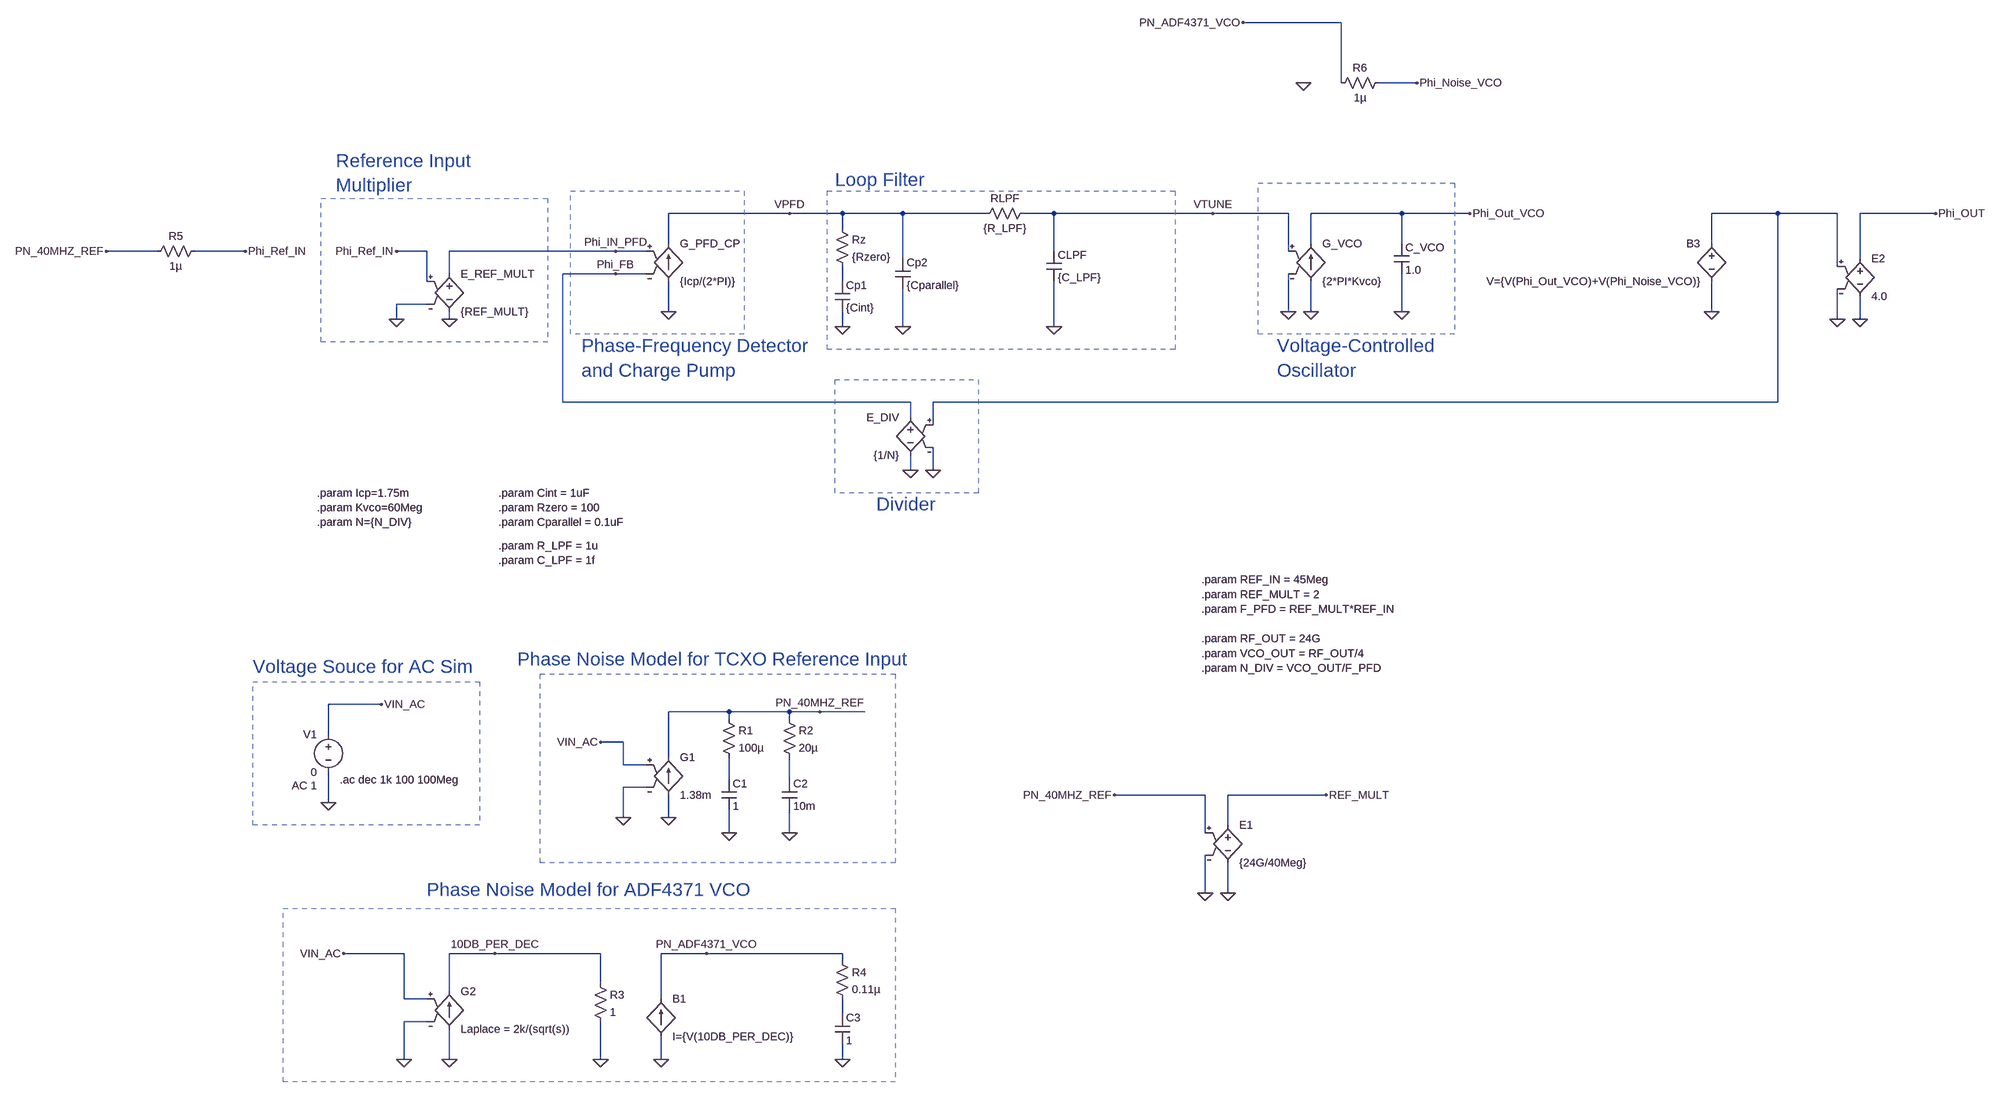
[diagram p0: schematic ADF4371_Freq_Synth_AC_Model.asc]
ADF4371_Freq_Synth_AC_Model.asc, the LTspice schematic file:
Version 4
SHEET 1 1592 2628
WIRE -64 -320 -272 -320
WIRE -64 -192 -64 -320
WIRE 96 -192 16 -192
WIRE -1232 128 -1488 128
WIRE -1120 128 -1232 128
WIRE -992 128 -1120 128
WIRE -816 128 -992 128
WIRE -672 128 -736 128
WIRE -336 128 -672 128
WIRE -176 128 -336 128
WIRE 64 128 -128 128
WIRE 208 128 64 128
WIRE 880 128 720 128
WIRE 1008 128 880 128
WIRE 1216 128 1056 128
WIRE -1120 160 -1120 128
WIRE -1488 192 -1488 128
WIRE -128 192 -128 128
WIRE 64 192 64 128
WIRE 720 192 720 128
WIRE -2576 208 -2688 208
WIRE -2384 208 -2496 208
WIRE -2000 208 -2064 208
WIRE -1600 208 -1952 208
WIRE -1536 208 -1600 208
WIRE -672 208 -672 128
WIRE -176 208 -176 128
WIRE -992 224 -992 128
WIRE 1056 224 1056 128
WIRE 1008 240 1008 128
WIRE -1952 256 -1952 208
WIRE -1600 256 -1712 256
WIRE -1536 256 -1600 256
WIRE -2000 272 -2000 208
WIRE -1120 272 -1120 240
WIRE -2000 320 -2064 320
WIRE -1488 336 -1488 272
WIRE -176 336 -176 256
WIRE -128 336 -128 272
WIRE 64 336 64 256
WIRE 720 336 720 272
WIRE -2064 352 -2064 320
WIRE -1952 352 -1952 336
WIRE 1008 352 1008 288
WIRE 1056 352 1056 304
WIRE -1120 368 -1120 336
WIRE -992 368 -992 288
WIRE -672 368 -672 272
WIRE -1712 528 -1712 256
WIRE -976 528 -1712 528
WIRE 880 528 880 128
WIRE 880 528 -928 528
WIRE -976 560 -976 528
WIRE -928 576 -928 528
WIRE -976 672 -976 640
WIRE -928 672 -928 624
WIRE -2096 1168 -2208 1168
WIRE -1360 1184 -1488 1184
WIRE -1232 1184 -1360 1184
WIRE -1168 1184 -1232 1184
WIRE -1072 1184 -1168 1184
WIRE -1360 1200 -1360 1184
WIRE -1232 1200 -1232 1184
WIRE -2208 1232 -2208 1168
WIRE -1584 1248 -1632 1248
WIRE -1488 1280 -1488 1184
WIRE -1584 1296 -1584 1248
WIRE -1536 1296 -1584 1296
WIRE -1360 1328 -1360 1280
WIRE -1232 1328 -1232 1280
WIRE -1536 1344 -1584 1344
WIRE -352 1360 -544 1360
WIRE -96 1360 -304 1360
WIRE -2208 1376 -2208 1312
WIRE -1584 1408 -1584 1344
WIRE -1488 1408 -1488 1360
WIRE -304 1424 -304 1360
WIRE -1360 1440 -1360 1392
WIRE -1232 1440 -1232 1392
WIRE -352 1440 -352 1360
WIRE -352 1568 -352 1488
WIRE -304 1568 -304 1504
WIRE -2048 1696 -2176 1696
WIRE -1856 1696 -1952 1696
WIRE -1632 1696 -1856 1696
WIRE -1408 1696 -1504 1696
WIRE -1120 1696 -1408 1696
WIRE -1120 1712 -1120 1696
WIRE -1632 1760 -1632 1696
WIRE -1952 1776 -1952 1696
WIRE -2048 1792 -2048 1696
WIRE -2000 1792 -2048 1792
WIRE -1504 1792 -1504 1696
WIRE -1120 1824 -1120 1792
WIRE -2000 1840 -2048 1840
WIRE -2048 1920 -2048 1840
WIRE -1952 1920 -1952 1856
WIRE -1632 1920 -1632 1840
WIRE -1504 1920 -1504 1872
WIRE -1120 1920 -1120 1888
FLAG -992 368 0
FLAG -1488 336 0
FLAG 64 336 0
FLAG -128 336 0
FLAG -176 336 0
FLAG 1216 128 Phi_OUT
FLAG -928 672 0
FLAG -976 672 0
FLAG -1600 256 Phi_FB
FLAG -1600 208 Phi_IN_PFD
FLAG -2208 1376 0
FLAG -1120 368 0
FLAG -336 128 VTUNE
FLAG 208 128 Phi_Out_VCO
FLAG 96 -192 Phi_Noise_VCO
FLAG 720 336 0
FLAG -1952 352 0
FLAG -2384 208 Phi_Ref_IN
FLAG -2064 352 0
FLAG -2064 208 Phi_Ref_IN
FLAG -672 368 0
FLAG -1232 128 VPFD
FLAG -1488 1408 0
FLAG -1584 1408 0
FLAG -1360 1440 0
FLAG -1232 1440 0
FLAG -1632 1248 VIN_AC
FLAG -1952 1920 0
FLAG -2048 1920 0
FLAG -1632 1920 0
FLAG -2176 1696 VIN_AC
FLAG -1856 1696 10DB_PER_DEC
FLAG -1504 1920 0
FLAG -1120 1920 0
FLAG -1408 1696 PN_ADF4371_VCO
FLAG -1168 1184 PN_40MHZ_REF
FLAG -2096 1168 VIN_AC
FLAG -272 -320 PN_ADF4371_VCO
FLAG -144 -192 0
FLAG -2688 208 PN_40MHZ_REF
FLAG -304 1568 0
FLAG -352 1568 0
FLAG -96 1360 REF_MULT
FLAG -544 1360 PN_40MHZ_REF
FLAG 1056 352 0
FLAG 1008 352 0
SYMBOL g -1488 176 R0
SYMATTR InstName G_PFD_CP
SYMATTR Value {Icp/(2*PI)}
SYMBOL cap -1008 224 R0
SYMATTR InstName Cp2
SYMATTR Value {Cparallel}
SYMBOL cap 48 192 R0
SYMATTR InstName C_VCO
SYMATTR Value 1.0
SYMBOL g -128 176 R0
SYMATTR InstName G_VCO
SYMATTR Value {2*PI*Kvco}
SYMBOL e -976 544 M0
SYMATTR InstName E_DIV
SYMATTR Value {1/N}
SYMBOL voltage -2208 1216 M0
WINDOW 123 24 124 Left 2
WINDOW 39 0 0 Left 2
SYMATTR Value2 AC 1
SYMATTR InstName V1
SYMATTR Value 0
SYMBOL cap -1136 272 R0
SYMATTR InstName Cp1
SYMATTR Value {Cint}
SYMBOL res -1136 144 R0
SYMATTR InstName Rz
SYMATTR Value {Rzero}
SYMBOL bv 720 176 M0
SYMATTR InstName B3
SYMATTR Value V={V(Phi_Out_VCO)+V(Phi_Noise_VCO)}
SYMBOL e -1952 240 R0
SYMATTR InstName E_REF_MULT
SYMATTR Value {REF_MULT}
SYMBOL res -720 112 R90
WINDOW 0 0 56 VBottom 2
WINDOW 3 32 56 VTop 2
SYMATTR InstName RLPF
SYMATTR Value {R_LPF}
SYMBOL cap -688 208 R0
SYMATTR InstName CLPF
SYMATTR Value {C_LPF}
SYMBOL g -1488 1264 R0
SYMATTR InstName G1
SYMATTR Value 1.38m
SYMBOL cap -1376 1328 R0
SYMATTR InstName C1
SYMATTR Value 1
SYMBOL res -1376 1184 R0
SYMATTR InstName R1
SYMATTR Value 100µ
SYMBOL cap -1248 1328 R0
SYMATTR InstName C2
SYMATTR Value 10m
SYMBOL res -1248 1184 R0
SYMATTR InstName R2
SYMATTR Value 20µ
SYMBOL g -1952 1760 R0
SYMATTR InstName G2
SYMATTR Value Laplace = 2k/(sqrt(s))
SYMBOL res -1648 1744 R0
SYMATTR InstName R3
SYMATTR Value 1
SYMBOL bi -1504 1872 M180
WINDOW 0 24 80 Left 2
WINDOW 3 24 0 Left 2
SYMATTR InstName B1
SYMATTR Value I={V(10DB_PER_DEC)}
SYMBOL cap -1136 1824 R0
SYMATTR InstName C3
SYMATTR Value 1
SYMBOL res -1136 1696 R0
SYMATTR InstName R4
SYMATTR Value 0.11µ
SYMBOL res -2480 192 R90
WINDOW 0 0 56 VBottom 2
WINDOW 3 32 56 VTop 2
SYMATTR InstName R5
SYMATTR Value 1µ
SYMBOL res 32 -208 R90
WINDOW 0 0 56 VBottom 2
WINDOW 3 32 56 VTop 2
SYMATTR InstName R6
SYMATTR Value 1µ
SYMBOL e -304 1408 R0
SYMATTR InstName E1
SYMATTR Value {24G/40Meg}
SYMBOL e 1056 208 R0
SYMATTR InstName E2
SYMATTR Value 4.0
TEXT -2232 720 Left 2 !.param Icp=1.75m\n.param Kvco=60Meg\n.param N={N_DIV}
TEXT -1136 56 Left 4 ;Loop Filter
TEXT -1672 408 Left 4 ;Phase-Frequency Detector\nand Charge Pump
TEXT -200 408 Left 4 ;Voltage-Controlled\nOscillator
TEXT -1048 744 Left 4 ;Divider
TEXT -1848 720 Left 2 !.param Cint = 1uF\n.param Rzero = 100\n.param Cparallel = 0.1uF
TEXT -360 904 Left 2 !.param REF_IN = 45Meg\n.param REF_MULT = 2\n.param F_PFD = REF_MULT*REF_IN\n \n.param RF_OUT = 24G\n.param VCO_OUT = RF_OUT/4\n.param N_DIV = VCO_OUT/F_PFD
TEXT -2192 16 Left 4 ;Reference Input\nMultiplier
TEXT -1848 832 Left 2 !.param R_LPF = 1u\n.param C_LPF = 1f
TEXT -2000 1560 Left 4 ;Phase Noise Model for ADF4371 VCO
TEXT -1808 1072 Left 4 ;Phase Noise Model for TCXO Reference Input
TEXT -2368 1088 Left 4 ;Voltage Souce for AC Sim
TEXT -2184 1328 Left 2 !.ac dec 1k 100 100Meg
RECTANGLE Normal -1328 384 -1696 80 2
RECTANGLE Normal -416 416 -1152 80 2
RECTANGLE Normal 176 384 -240 64 2
RECTANGLE Normal -832 720 -1136 480 2
RECTANGLE Normal -1744 400 -2224 96 2
RECTANGLE Normal -1008 1968 -2304 1600 2
RECTANGLE Normal -1008 1504 -1760 1104 2
RECTANGLE Normal -1888 1424 -2368 1120 2

The netlist it stands for:
* ADF4371_Freq_Synth_AC_Model.asc
G_PFD_CP 0 VPFD Phi_IN_PFD Phi_FB {Icp/(2*PI)}
Cp2 VPFD 0 {Cparallel}
C_VCO Phi_Out_VCO 0 1.0
G_VCO 0 Phi_Out_VCO VTUNE 0 {2*PI*Kvco}
E_DIV Phi_FB 0 N001 0 {1/N}
V1 VIN_AC 0 0 AC 1
Cp1 N002 0 {Cint}
Rz VPFD N002 {Rzero}
B3 N001 0 V={V(Phi_Out_VCO)+V(Phi_Noise_VCO)}
E_REF_MULT Phi_IN_PFD 0 Phi_Ref_IN 0 {REF_MULT}
RLPF VTUNE VPFD {R_LPF}
CLPF VTUNE 0 {C_LPF}
G1 0 PN_40MHZ_REF VIN_AC 0 1.38m
C1 N003 0 1
R1 PN_40MHZ_REF N003 100µ
C2 N004 0 10m
R2 PN_40MHZ_REF N004 20µ
G2 0 10DB_PER_DEC VIN_AC 0 Laplace = 2k/(sqrt(s))
R3 10DB_PER_DEC 0 1
B1 0 PN_ADF4371_VCO I={V(10DB_PER_DEC)}
C3 N005 0 1
R4 PN_ADF4371_VCO N005 0.11µ
R5 Phi_Ref_IN PN_40MHZ_REF 1µ
R6 Phi_Noise_VCO PN_ADF4371_VCO 1µ
E1 REF_MULT 0 PN_40MHZ_REF 0 {24G/40Meg}
E2 Phi_OUT 0 N001 0 4.0
.param Icp=1.75m
.param Kvco=60Meg
.param N={N_DIV}
* Loop Filter
* Phase-Frequency Detector
* and Charge Pump
* Voltage-Controlled
* Oscillator
* Divider
.param Cint = 1uF
.param Rzero = 100
.param Cparallel = 0.1uF
.param REF_IN = 45Meg
.param REF_MULT = 2
.param F_PFD = REF_MULT*REF_IN
.param RF_OUT = 24G
.param VCO_OUT = RF_OUT/4
.param N_DIV = VCO_OUT/F_PFD
* Reference Input
* Multiplier
.param R_LPF = 1u
.param C_LPF = 1f
* Phase Noise Model for ADF4371 VCO
* Phase Noise Model for TCXO Reference Input
* Voltage Souce for AC Sim
.ac dec 1k 100 100Meg
.backanno
.end